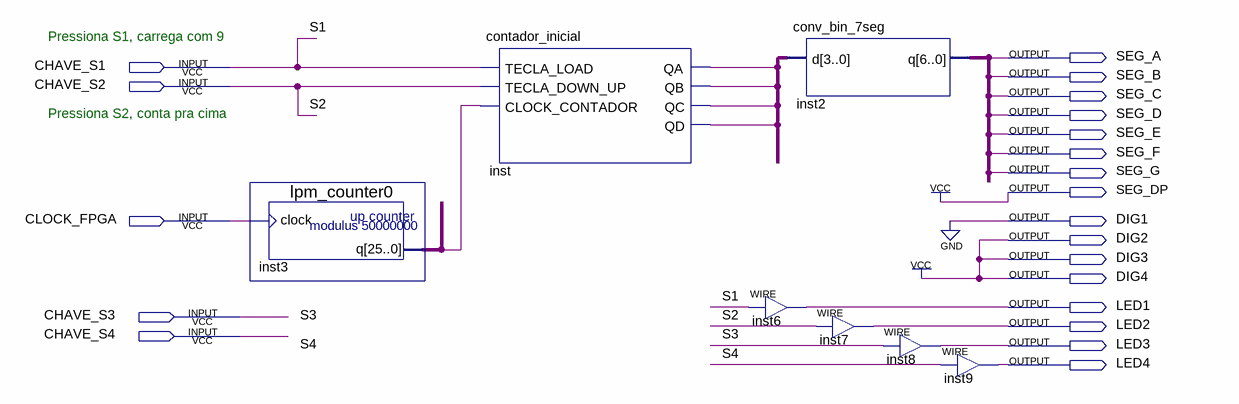
[diagram p0: schematic sheet]
// Quartus schematic contador_final.bdf as structural Verilog: 7 symbols, 21 pins
module contador_final (
  input  CHAVE_S1,
  input  CHAVE_S2,
  input  CLOCK_FPGA,
  input  CHAVE_S3,
  input  CHAVE_S4,
  output SEG_A,
  output SEG_B,
  output SEG_C,
  output SEG_D,
  output SEG_E,
  output SEG_F,
  output SEG_G,
  output SEG_DP,
  output DIG1,
  output DIG2,
  output DIG3,
  output DIG4,
  output LED1,
  output LED2,
  output LED3,
  output LED4
);

  wire [3:0] in_conv7seg;
  wire [25:0] lpmq;

  lpm_counter0 inst3 (.clock(CLOCK_FPGA), .q(lpmq));
  contador_inicial inst (
    .TECLA_LOAD(CHAVE_S1), .TECLA_DOWN_UP(CHAVE_S2), .CLOCK_CONTADOR(lpmq[25]), .QA(in_conv7seg[0]),
    .QB(in_conv7seg[1]), .QC(in_conv7seg[2]), .QD(in_conv7seg[3]));
  conv_bin_7seg inst2 (.d(in_conv7seg), .q({SEG_A, SEG_B, SEG_C, SEG_D, SEG_E, SEG_F, SEG_G}));
  assign LED1 = CHAVE_S1;  // WIRE inst6
  assign LED2 = CHAVE_S2;  // WIRE inst7
  assign LED3 = CHAVE_S3;  // WIRE inst8
  assign LED4 = CHAVE_S4;  // WIRE inst9

  assign DIG1 = 1'b0;
  assign DIG2 = 1'b1;
  assign DIG3 = 1'b1;
  assign DIG4 = 1'b1;
  assign SEG_DP = 1'b1;

  // Other names for the same wires on the sheet: S1 = CHAVE_S1; S2 = CHAVE_S2;
  //   out_7seg[6:0] = {SEG_A, SEG_B, SEG_C, SEG_D, SEG_E, SEG_F, SEG_G}; S3 = CHAVE_S3; S4 = CHAVE_S4

  // Notes on the sheet:
  //   Pressiona S1, carrega com 9
  //   Pressiona S2, conta pra cima
endmodule
